# EAGLE design queso_dip_v101 (EAGLE 7.7.0)
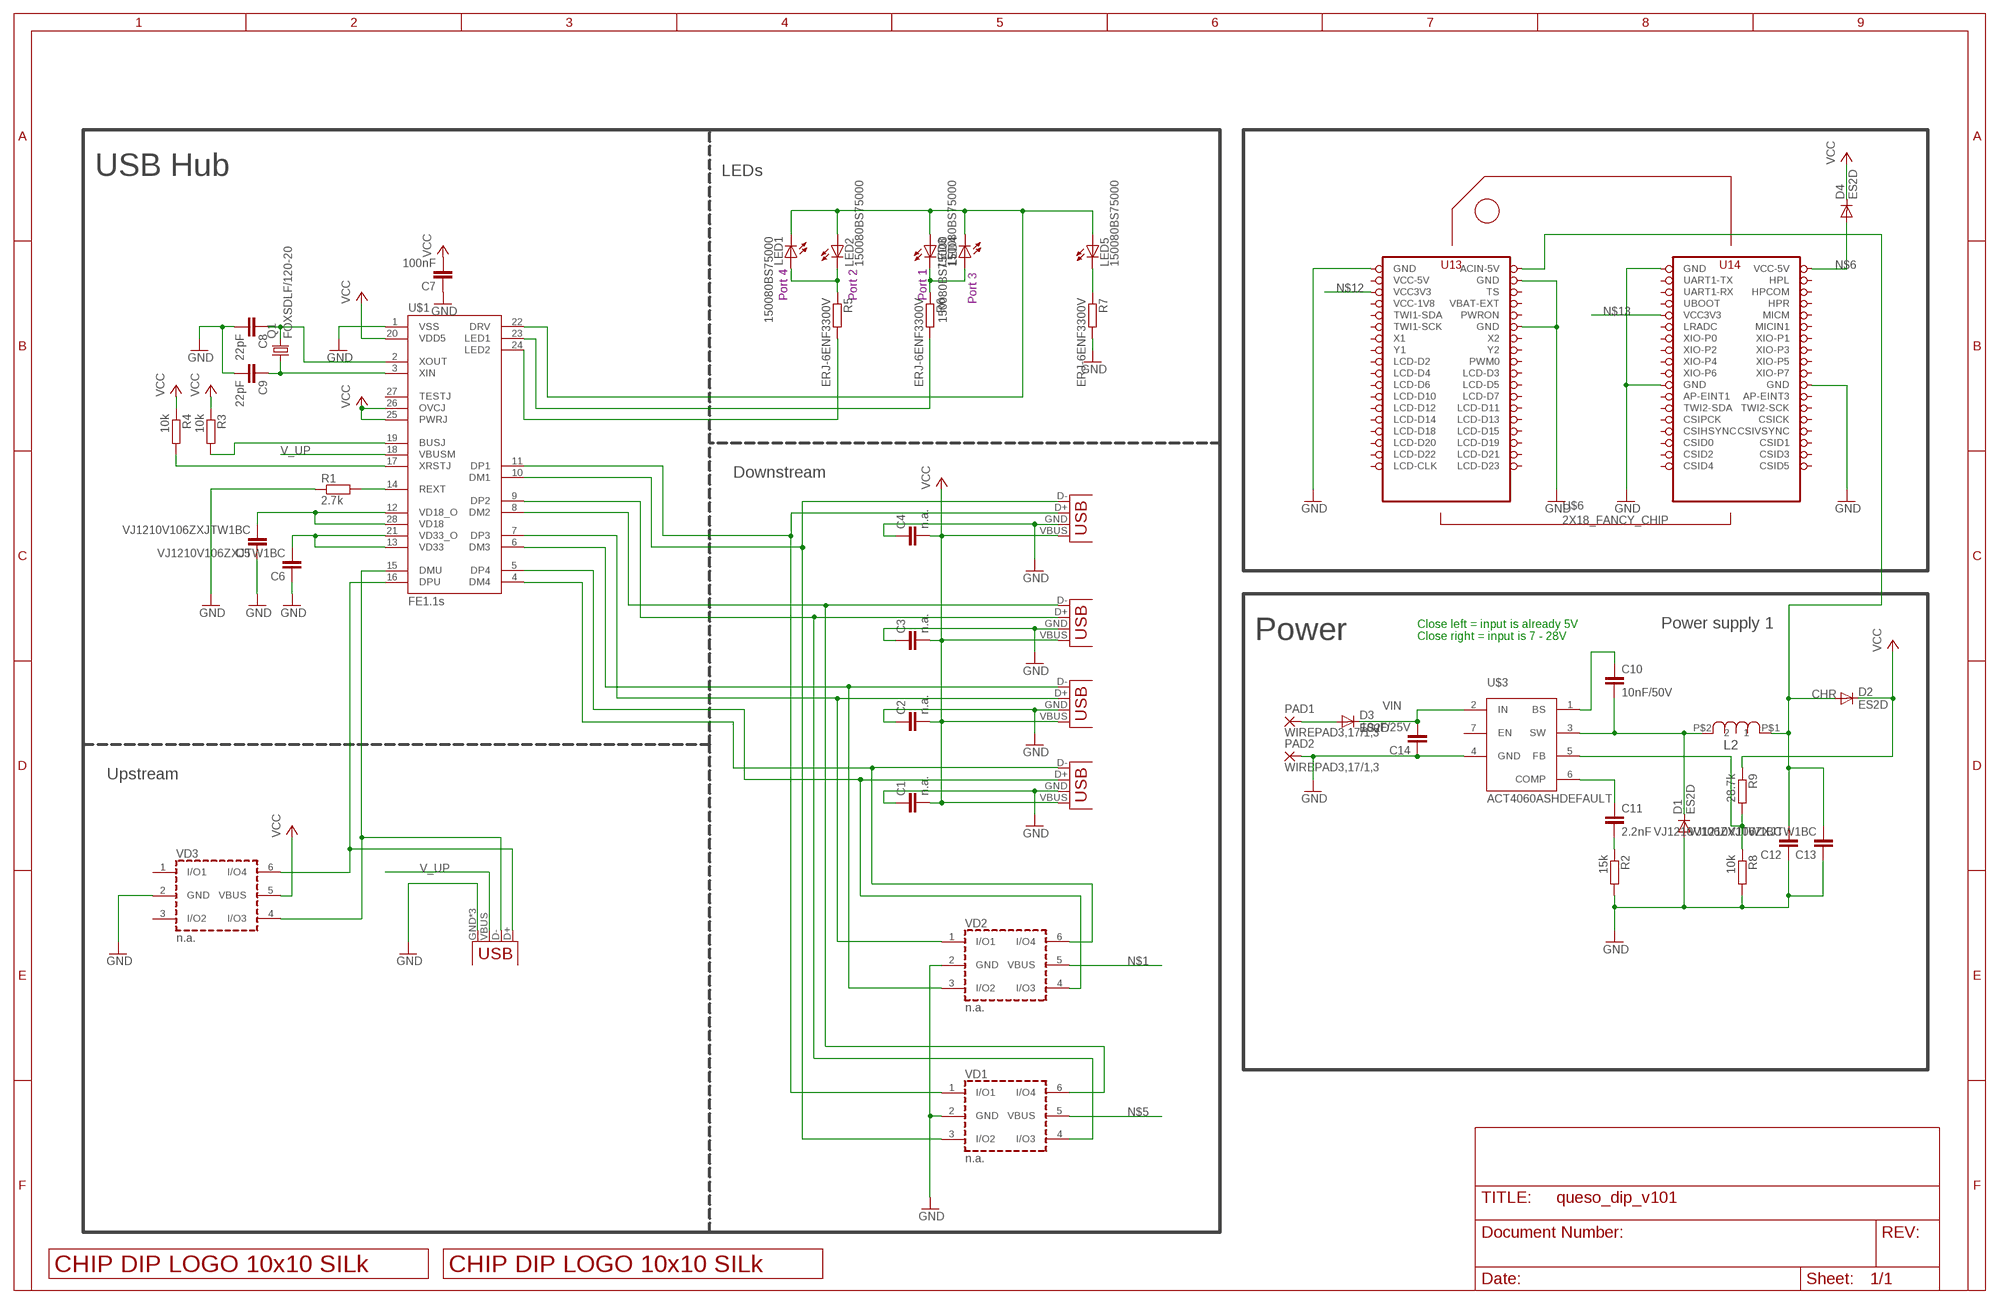
[diagram p0: schematic, sheet 1]

## Parts
C1  n.a.  C-EUC1210  [C1210]
C2  n.a.  C-EUC1210  [C1210]
C3  n.a.  C-EUC1210  [C1210]
C4  n.a.  C-EUC1210  [C1210]
C5  VJ1210V106ZXJTW1BC  C-EUC1210  [C1210]
C6  VJ1210V106ZXJTW1BC  C-EUC1210  [C1210]
C7  100nF  C-EUC0805  [C0805]
C8  22pF  C-EUC0805  [C0805]
C9  22pF  C-EUC0805  [C0805]
C10  10nF/50V  C-EUC0805  [C0805]
C11  2.2nF  C-EUC0805  [C0805]
C12  VJ1210V106ZXJTW1BC  C-EUC1210  [C1210]
C13  VJ1210V106ZXJTW1BC  C-EUC1210  [C1210]
C14  10uF/25V  C-EUC1210  [C1210]
D1  ES2D  [SMB]
D2  ES2D  [SMB]
D3  ES2D  [SMB]
D4  ES2D  [SMB]
DATA_USB  USBUSB-MICROB-SMT-DIP  [USB-MICROB-SMT-DIP]
L2  SRN6045-100M  [SRN6045]
LED1  150080BS75000  LEDCHIP-LED0805  [CHIP-LED0805]
LED2  150080BS75000  LEDCHIP-LED0805  [CHIP-LED0805]
LED3  150080BS75000  LEDCHIP-LED0805  [CHIP-LED0805]
LED4  150080BS75000  LEDCHIP-LED0805  [CHIP-LED0805]
LED5  150080BS75000  LEDCHIP-LED0805  [CHIP-LED0805]
PAD1  WIREPAD3,17/1,3  [3,17/1,3]
PAD2  WIREPAD3,17/1,3  [3,17/1,3]
Q1  FOXSDLF/120-20  CRYSTALSM49  [SM49]
R1  2.7k  R-EU_R0805  [R0805]
R2  15k  R-EU_R0805  [R0805]
R3  10k  R-EU_R0805  [R0805]
R4  10k  R-EU_R0805  [R0805]
R5  ERJ-6ENF3300V  R-EU_R0805  [R0805]
R6  ERJ-6ENF3300V  R-EU_R0805  [R0805]
R7  ERJ-6ENF3300V  R-EU_R0805  [R0805]
R8  10k  R-EU_R0805  [R0805]
R9  28.7k  R-EU_R0805  [R0805]
U$1  FE1.1S  [FE1.1S_SSOP-28]
U$2  LOGO_10X10_SILK  [LOGO2_10X10_SILK]
U$3  ACT4060ASHDEFAULT  [SOP-8]
U$4  LOGO_10X10_SILK  [LOGO2_10X10_SILK]
U$6  2X18_FANCY_CHIP  [2X18_FANCY_EDGE_CHIP_TH]
VD1  n.a.  USBLC6-4SC6  [SOT-23-6L]
VD2  n.a.  USBLC6-4SC6  [SOT-23-6L]
VD3  n.a.  USBLC6-4SC6  [SOT-23-6L]
X1  USB-A-HU  [USB-A-HU]
X2  USB-A-HU  [USB-A-HU]
X3  USB-A-HU  [USB-A-HU]
X4  USB-A-HU  [USB-A-HU]

## Nets
CHR: C12.2 C13.2 D2.A L2.P$1 U$6.36(ACIN-5V)
DM1: U$1.10(DM1) VD1.3(I/O2) X4.D-(D+)
DM2: U$1.8(DM2) VD1.6(I/O4) X3.D-(D+)
DM3: U$1.6(DM3) VD2.3(I/O2) X2.D-(D+)
DM4: U$1.4(DM4) VD2.6(I/O4) X1.D-(D+)
DMU: DATA_USB.D- U$1.15(DMU) VD3.4(I/O3)
DP1: U$1.11(DP1) VD1.1(I/O1) X4.D+(D-)
DP2: U$1.9(DP2) VD1.4(I/O3) X3.D+(D-)
DP3: U$1.7(DP3) VD2.1(I/O1) X2.D+(D-)
DP4: U$1.5(DP4) VD2.4(I/O3) X1.D+(D-)
DPU: DATA_USB.D+ U$1.16(DPU) VD3.6(I/O4)
GND: C1.1 C2.1 C3.1 C4.1 C5.1 C6.1 C7.1 C8.2 C9.2 C12.1 C13.1 C14.1 D1.A DATA_USB.GND DATA_USB.MT1(GND) DATA_USB.MT2(GND) PAD2.1(P) R1.1 R7.2 R8.2 U$1.1(VSS) U$3.4(GND) U$6.26(GND) U$6.34(GND) U$6.35(GND) U$6.51(GND) U$6.52(GND) U$6.71(GND) VD1.2(GND) VD2.2(GND) VD3.2(GND) X1.GND(VBUS) X2.GND(VBUS) X3.GND(VBUS) X4.GND(VBUS)
N$1: VD2.5(VBUS)
N$2: D3.A PAD1.1(P)
N$5: VD1.5(VBUS)
N$6: D4.A U$6.72(VCC-5V)
N$7: C10.2 D1.C L2.P$2 U$3.3(SW)
N$8: C10.1 U$3.1(BS)
N$9: C11.2 R2.1
N$10: C11.1 U$3.6(COMP)
N$11: R8.1 R9.2 U$3.5(FB)
N$12: U$6.31(VCC3V3)
N$13: U$6.63(VCC3V3)
N$14: R5.2 U$1.24(LED2)
N$15: R6.2 U$1.23(LED1)
N$17: C6.2 U$1.13(VD33) U$1.21(VD33_O)
N$18: C5.2 U$1.12(VD18_O) U$1.28(VD18)
N$22: R1.2 U$1.14(REXT)
N$24: R4.2 U$1.17(XRSTJ)
N$25: R3.2 U$1.19(BUSJ)
N$27: C8.1 Q1.2 U$1.2(XOUT)
N$28: C9.1 Q1.1 U$1.3(XIN)
N$29: LED5.C R7.1
N$30: LED3.C LED4.A R6.1
N$31: LED1.A LED2.C R5.1
N$32: LED1.C LED2.A LED3.A LED4.C LED5.A U$1.22(DRV)
V_UP: DATA_USB.VBUS U$1.18(VBUSM)
VCC: C1.2 C2.2 C3.2 C4.2 C7.2 D2.C D4.C R3.1 R4.1 R9.1 U$1.20(VDD5) U$1.25(PWRJ) U$1.26(OVCJ) VD3.5(VBUS) X1.VBUS(GND) X2.VBUS(GND) X3.VBUS(GND) X4.VBUS(GND)
VIN: C14.2 D3.C U$3.2(IN)
Unconnected: R2.2 U$1.27(TESTJ) U$3.7(EN) U$6.1(LCD-CLK) U$6.2(LCD-D23) U$6.3(LCD-D22) U$6.4(LCD-D21) U$6.5(LCD-D20) U$6.6(LCD-D19) U$6.7(LCD-D18) U$6.8(LCD-D15) U$6.9(LCD-D14) U$6.10(LCD-D13) U$6.11(LCD-D12) U$6.12(LCD-D11) U$6.13(LCD-D10) U$6.14(LCD-D7) U$6.15(LCD-D6) U$6.16(LCD-D5) U$6.17(LCD-D4) U$6.18(LCD-D3) U$6.19(LCD-D2) U$6.20(PWM0) U$6.21(Y1) U$6.22(Y2) U$6.23(X1) U$6.24(X2) U$6.25(TWI1-SCK) U$6.27(TWI1-SDA) U$6.28(PWRON) U$6.30(VBAT-EXT) U$6.32(TS) U$6.37(CSID4) U$6.38(CSID5) U$6.39(CSID2) U$6.40(CSID3) U$6.41(CSID0) U$6.42(CSID1) U$6.43(CSIHSYNC) U$6.44(CSIVSYNC) U$6.45(CSIPCK) U$6.46(CSICK) U$6.47(TWI2-SDA) U$6.48(TWI2-SCK) U$6.49(AP-EINT1) U$6.50(AP-EINT3) U$6.53(XIO-P6) U$6.54(XIO-P7) U$6.55(XIO-P4) U$6.56(XIO-P5) U$6.57(XIO-P2) U$6.58(XIO-P3) U$6.59(XIO-P0) U$6.60(XIO-P1) U$6.61(LRADC) U$6.62(MICIN1) U$6.64(MICM) U$6.65(UBOOT) U$6.66(HPR) U$6.67(UART1-RX) U$6.68(HPCOM) U$6.69(UART1-TX) U$6.70(HPL) VD3.1(I/O1) VD3.3(I/O2)

## Notes on the sheet
- USB Hub | LEDs
- Port 4 | Port 2 | Port 1
- Port 3
- Downstream
- Power supply 1
- Power
- Close left = input is already 5V
  Close right = input is 7 - 28V
- Upstream

## Power pins joined to a net without a drawn wire
VCC-1V8: U$6.29(VCC-1V8)
VCC-5V: U$6.33(VCC-5V)

## Library data of the parts
C1-C14 = rcl:C-EU: CAPACITOR, European symbol
D1-D4 = diode:ES2D: DIODE super fast rectifier, 2 A
DATA_USB = Spark:USB
L2 = Keyboard v0_5:SRN6045-100M; DESCRIPTION: power inductor 10uH 2.5A 58.6 mohm; FOOTPRINT: SRN6045; LINK: http://www.digikey.com/product-detail/en/SRN6045-100M/SRN6045-100MTR-ND/2756120; MFG: DIGIKEY; MFG_PN: SRN6045-100MTR-ND; PART_TYPE: IND; PRICE: 0.15; TOLLERANCE: ±20%; VENDOR: BOURNS; VENDOR_PART_NUMBER: SRN6045-100M
LED1-LED5 = led:LED: LED OSRAM: - CHIPLED LG R971, LG N971, LY N971, LG Q971, LY Q971, LO R971, LY R971 LH N974, LH R974 LS Q976, LO Q976, LY Q976 LO Q996 - Hyper CHIPLED LW Q18S LB Q993, LB Q99A, LB R99A - SideLED LS A670, LO A670, LY A670, LG A670, LP A670 LB A673, LV A673, LT A673, LW A673 LH A674 LY A675 LS A676, LA A676, LO A676, LY A676, LW A676 LS A679, LY A679, LG A679 - Hyper Micro SIDELED® LS Y876, LA Y876, LO Y876, LY Y876 LT Y87S - SmartLED LW L88C, LW L88S LB L89C, LB L89S, LG L890 LS L89K, LO L89K, LY L89K LS L896, LA L896, LO L896, LY L896 - TOPLED LS T670, LO T670, LY T670, LG T670, LP T670 LSG T670, LSP T670, LSY T670, LOP T670, LYG T670 LG T671, LOG T671, LSG T671 LB T673, LV T673, LT T673, LW T673 LH T674 LS T676, LA T676, LO T676, LY T676, LB T676, LH T676, LSB T676, LW T676 LB T67C, LV T67C, LT T67C, LS T67K, LO T67K, LY T67K, LW E67C LS E67B, LA E67B, LO E67B, LY E67B, LB E67C, LV E67C, LT E67C LW T67C LS T679, LY T679, LG T679 LS T770, LO T770, LY T770, LG T770, LP T770 LB T773, LV T773, LT T773, LW T773 LH T774 LS E675, LA E675, LY E675, LS T675 LS T776, LA T776, LO T776, LY T776, LB T776 LHGB T686 LT T68C, LB T68C - Hyper Mini TOPLED® LB M676 - Mini TOPLED Santana® LG M470 LS M47K, LO M47K, LY M47K Source: http://www.osram.convergy.de LUXEON: - LUMILED® LXK2-PW12-R00, LXK2-PW12-S00, LXK2-PW14-U00, LXK2-PW14-V00 LXK2-PM12-R00, LXK2-PM12-S00, LXK2-PM14-U00 LXK2-PE12-Q00, LXK2-PE12-R00, LXK2-PE12-S00, LXK2-PE14-T00, LXK2-PE14-U00 LXK2-PB12-K00, LXK2-PB12-L00, LXK2-PB12-M00, LXK2-PB14-N00, LXK2-PB14-P00, LXK2-PB14-Q00 LXK2-PR12-L00, LXK2-PR12-M00, LXK2-PR14-Q00, LXK2-PR14-R00 LXK2-PD12-Q00, LXK2-PD12-R00, LXK2-PD12-S00 LXK2-PH12-R00, LXK2-PH12-S00 LXK2-PL12-P00, LXK2-PL12-Q00, LXK2-PL12-R00 Source: www.luxeon.com KINGBRIGHT: KA-3528ASYC Source: www.kingbright.com
PAD1 PAD2 = wirepad:WIREPAD: Wire PAD connect wire on PCB
Q1 = adafruit:CRYSTAL: CRYSTAL; OC_FARNELL: unknown; OC_NEWARK: unknown
R1-R9 = rcl:R-EU_: RESISTOR, European symbol
U$1 = imcom:FE1.1S: A USB 2.0 hub IC. http://www.jfd-ic.com/Documents/FE1.1s%20Data%20Sheet%20%28Rev.%201.0%29.pdf
U$2 U$4 = JKW_CHIP:LOGO_10X10_SILK
U$3 = JKW_CHIP:ACT4060ASH
U$6 = JKW_CHIP:2X18_FANCY_CHIP
VD1-VD3 = usblc6:USBLC6-4: Automotive very low capacitance ESD protection 4 line Features 4 data-line protection Protects V BUS Very low capacitance: 3 pF Very low leakage current: 10 nA SOT23-6L package RoHS compliant AEC Q101 qualified
X1-X4 = con-usb:USB: USB Connectors

## Board
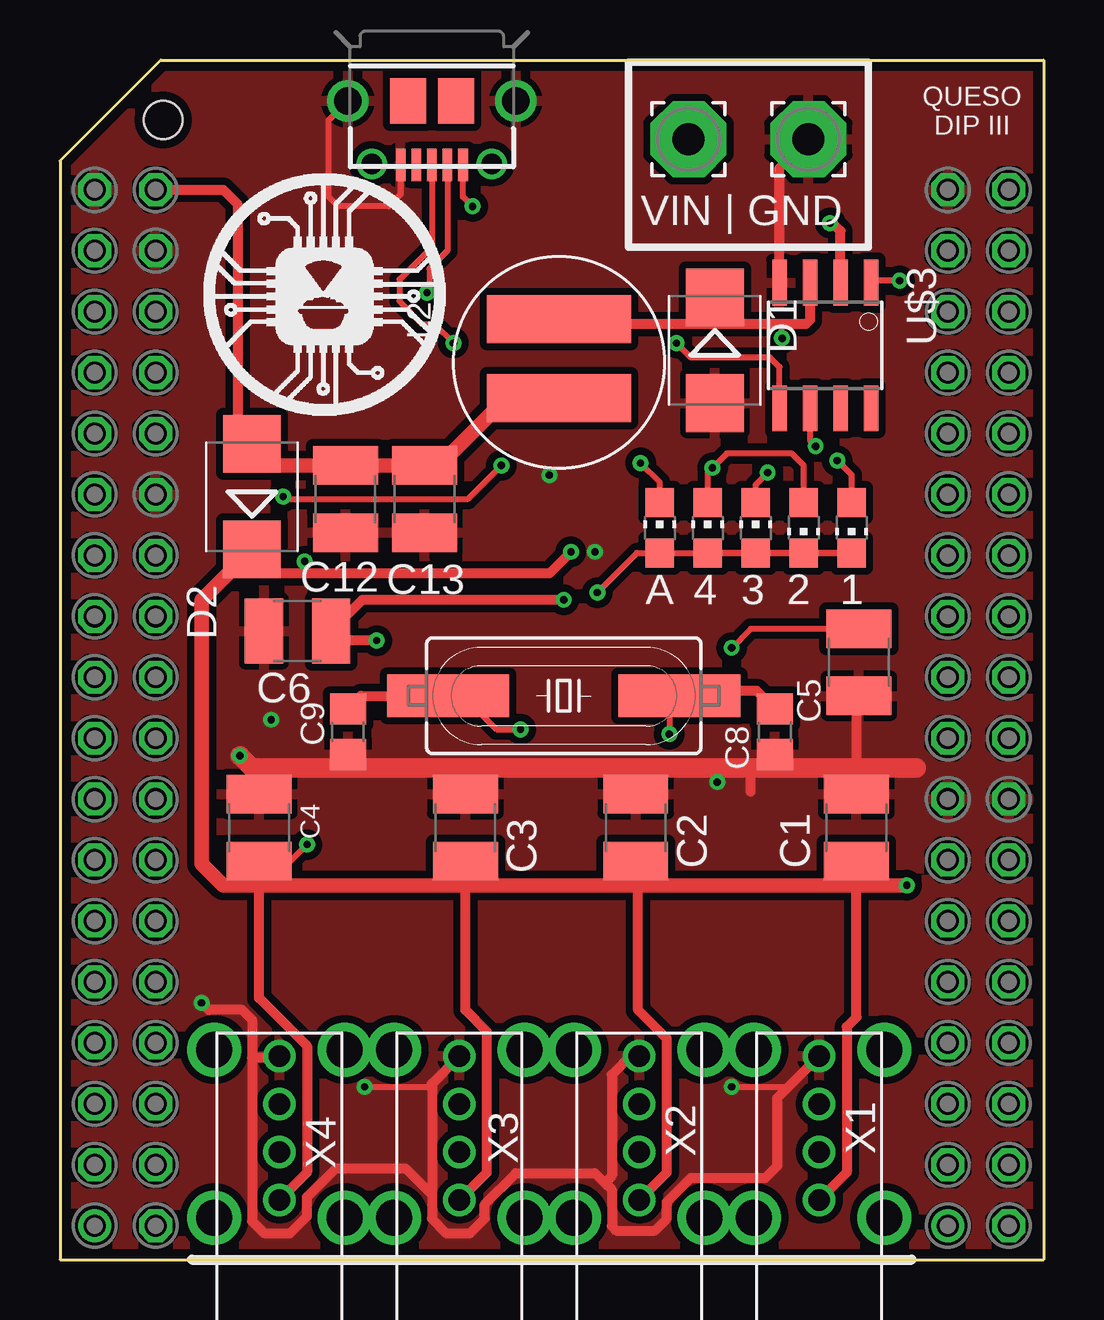
[diagram p1: board, top side]
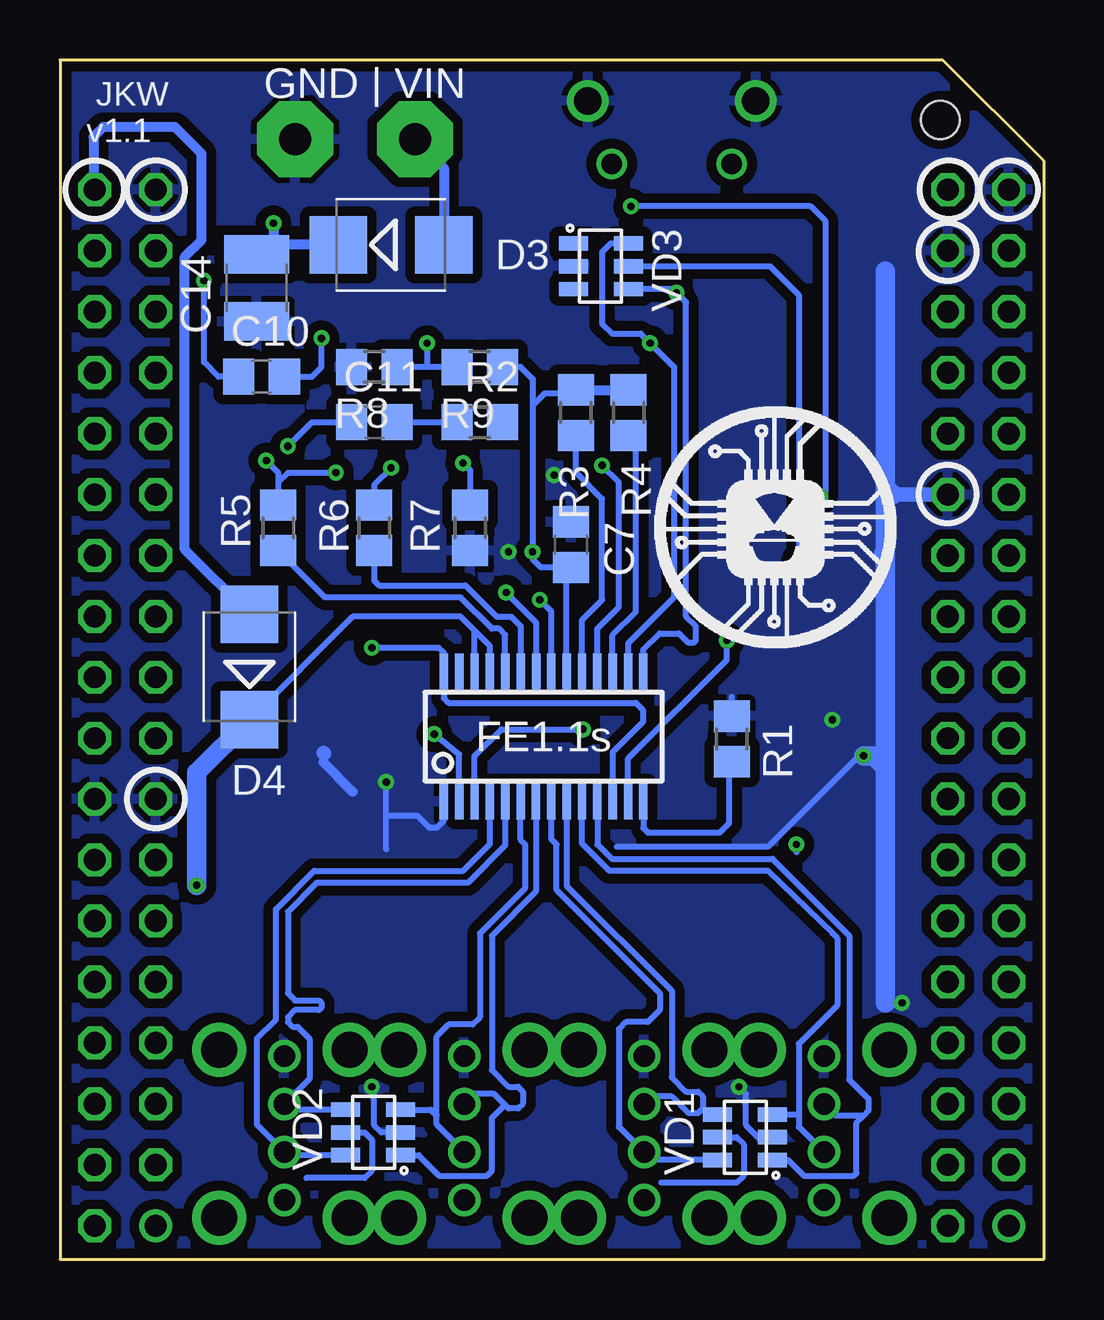
[diagram p2: board, bottom side, seen from below]

Size 41 x 50 mm. Coordinates in mm from the lower left corner, seen from the top.
Copper layers (1*16): Top 0.0356mm / dielectric 1.5011mm / Bottom 0.0356mm
Design rules "LaenPCBOrder": minimum track width 6mil, minimum drill 13mil, track to track 6mil, track to pad 6mil, pad to pad 6mil, via to via 6mil, smd to smd 6mil, copper to edge 15mil, drill to drill 6mil, minimum pad ring 7mil, minimum via ring 7mil, stop-mask expansion 3mil, vias tented up to drill 0mil, thermal gap 10mil
Holes 1.6 mm at 4.3,47.5

### Footprints (pad centres in the part's own frame; a part is rotated, then mirrored left to right if it is on the bottom)
C1210 = smd 1.6 x 2.7: 1 -1.4,0; 2 1.4,0
C0805 = smd 1.3 x 1.5: 1 -0.95,0; 2 0.95,0
SMB = smd 2.4 x 2.4: A 2.2,0; C -2.2,0
USB-MICROB-SMT-DIP = smd 0.4 x 1.35: D+ 0,2.675; D- -0.65,2.675; GND 1.3,2.675; ID 0.65,2.675; VBUS -1.3,2.675 | drill 1.15 pad 1.7: MT1 -3.5,0; MT2 3.5,0 | drill 0.85 pad 1.25: MT3 -2.5,2.625; MT4 2.5,2.625 | smd 1.5 x 1.9: P$1 -1,0; P$2 1,0.01
SRN6045 = smd 2 x 6: P$1 1.5,0; P$2 -1.8,0
CHIP-LED0805 = smd 1.2 x 1.2: A 0,-1.05; C 0,1.05
3,17/1,3 = drill 1.321 pad 3.175 octagon: 1 0,0
SM49 = smd 5.08 x 1.778: 1 -4.826,0; 2 4.826,0
R0805 = smd 1.3 x 1.5: 1 -0.95,0; 2 0.95,0
FE1.1S_SSOP-28 = smd 0.35 x 1.5: 1 -4.16,-2.7; 2 -3.52,-2.7; 3 -2.88,-2.7; 4 -2.24,-2.7; 5 -1.6,-2.7; 6 -0.96,-2.7; 7 -0.32,-2.7; 8 0.32,-2.7; 9 0.96,-2.7; 10 1.6,-2.7; 11 2.24,-2.7; 12 2.88,-2.7; 13 3.52,-2.7; 14 4.16,-2.7; 15 4.16,2.7; 16 3.52,2.7; 17 2.88,2.7; 18 2.24,2.7; 19 1.6,2.7; 20 0.96,2.7; 21 0.32,2.7; 22 -0.3,2.7; 23 -0.96,2.7; 24 -1.6,2.7; 25 -2.24,2.7; 26 -2.88,2.7; 27 -3.52,2.7; 28 -4.16,2.7
SOP-8 = smd 1.905 x 0.61: 1 -2.616,1.905; 2 -2.616,0.635; 3 -2.616,-0.635; 4 -2.616,-1.905; 5 2.616,-1.905; 6 2.616,-0.635; 7 2.616,0.635; 8 2.616,1.905
2X18_FANCY_EDGE_CHIP_TH = drill 0.914: 1 1.45,1.41; 37 37.01,1.41 | drill 0.914 octagon: 2 3.99,1.41; 3 1.45,3.95; 4 3.99,3.95; 5 1.45,6.49; 6 3.99,6.49; 7 1.45,9.03; 8 3.99,9.03; 9 1.45,11.57; 10 3.99,11.57; 11 1.45,14.11; 12 3.99,14.11; 13 1.45,16.65; 14 3.99,16.65; 15 1.45,19.19; 16 3.99,19.19; 17 1.45,21.73; 18 3.99,21.73; 19 1.45,24.27; 20 3.99,24.27; 21 1.45,26.81; 22 3.99,26.81; 23 1.45,29.35; 24 3.99,29.35; 25 1.45,31.89; 26 3.99,31.89; 27 1.45,34.43; 28 3.99,34.43; 29 1.45,36.97; 30 3.99,36.97; 31 1.45,39.51; 32 3.99,39.51; 33 1.45,42.05; 34 3.99,42.05; 35 1.45,44.59; 36 3.99,44.59; 38 39.55,1.41; 39 37.01,3.95; 40 39.55,3.95; 41 37.01,6.49; 42 39.55,6.49; 43 37.01,9.03; 44 39.55,9.03; 45 37.01,11.57; 46 39.55,11.57; 47 37.01,14.11; 48 39.55,14.11; 49 37.01,16.65; 50 39.55,16.65; 51 37.01,19.19; 52 39.55,19.19; 53 37.01,21.73; 54 39.55,21.73; 55 37.01,24.27; 56 39.55,24.27; 57 37.01,26.81; 58 39.55,26.81; 59 37.01,29.35; 60 39.55,29.35; 61 37.01,31.89; 62 39.55,31.89; 63 37.01,34.43; 64 39.55,34.43; 65 37.01,36.97; 66 39.55,36.97; 67 37.01,39.51; 68 39.55,39.51; 69 37.01,42.05; 70 39.55,42.05; 71 37.01,44.59; 72 39.55,44.59 | hole 1.6: 4.3,47.5
SOT-23-6L = smd 0.6 x 1.2: 1 -0.95,-2.3; 2 0,-2.3; 3 0.95,-2.3; 4 0.95,0; 5 0,0; 6 -0.95,0
USB-A-HU = drill 0.9: D+ 4.73,0; D- 2.73,0; GND 6.73,0; VBUS 0.73,0 | drill 1.5: P$5 0,2.72; P$6 0,-2.72; P$7 7,2.72; P$8 7,-2.72

### Placement (x,y rotation side)
C1  33.2,18 270 top
C2  24,18 270 top
C3  16.9,18 270 top
C4  8.3,18 270 top
C5  33.3,24.9 90 top
C6  9.9,26.2 0 top
C7  19.7,29.8 270 bottom
C8  29.8,22 270 top
C9  12,22 270 top
C10  32.6,36.8 0 bottom
C11  27.9,34.9 0 bottom
C12  11.9,31.7 90 top
C13  15.2,31.7 90 top
C14  32.8,40.5 90 bottom
D1  27.3,37.9 270 top
D2  8,31.8 90 top
D3  27.2,42.3 0 bottom
D4  33.1,24.7 90 bottom
DATA_USB  15.5,48.3 180 top
L2  20.8,37.4 270 top
LED1  33,30.5 180 top
LED2  29,30.5 0 top
LED3  27,30.5 0 top
LED4  31,30.5 180 top
LED5  25,30.5 0 top
PAD1  26.2,46.7 0 top
PAD2  31.2,46.7 0 top
Q1  21,23.5 0 top
R1  13,21.7 270 bottom
R2  23.5,34.9 0 bottom
R3  19.5,35.3 270 bottom
R4  17.3,35.3 270 bottom
R5  31.9,30.5 270 bottom
R6  27.9,30.5 270 bottom
R7  23.9,30.5 270 bottom
R8  27.9,37.2 180 bottom
R9  23.5,37.2 180 bottom
U$1  20.84,21.8 0 bottom
U$2  16.2,25.5 0 bottom
U$3  31.9,38.1 270 top
U$4  6,35.2 0 top
U$6  0,0 0 top
VD1  13.6,5.1 90 bottom
VD2  29.1,5.3 90 bottom
VD3  17.3,41.4 270 bottom
X1  31.65,1.75 90 top
X2  24.15,1.75 90 top
X3  16.65,1.75 90 top
X4  9.15,1.75 90 top

### Tracks (layer width: path | path; a pad name or v marks a point on that pad's centre or on a via)
CHR
  Top 0.406: U$6.36 6.81,44.59 7.4,44 7.4,34.6 D2.A
  Top 0.61: L2.P$1 20.6,35.7 18.4,35.7 15.9,33.2 15.3,33.2 C13.2 C12.2 8.9,33.1 D2.A
DM1
  Bottom 0.254: U$1.10 19.24,17.34 18.1,16.2 11.5,16.2 8.79,13.59 8.6,13.4 8.6,10.6 10.2,9 10.2,6 | 10.2,6 10.2,5.53 X4.D- | VD1.3 10.25,6.05 10.2,6
DM2
  Bottom 0.254: U$1.8 20.52,17.52 20.3,17.3 20.3,15.4 16,11.1 16,10.4 16.5,9.9 17.4,9.9 17.7,9.6 17.7,5.53 X3.D- 16.32,4.15 VD1.6
DM3
  Bottom 0.254: U$1.6 21.8,17.5 21.6,17.3 21.6,15.5 23.5,13.6 23.5,10.1 23.8,9.8 24.8,9.8 25.3,9.3 25.3,6 | X2.D- 25.3,5.63 25.3,6 | VD2.3 25.55,6.25 25.3,6
DM4
  Bottom 0.254: U$1.4 23.08,17.32 24.2,16.2 30.4,16.2 32,14.6 32,10 32.8,9.2 32.8,5.63 X1.D- 31.52,4.35 VD2.6
DMU  (via drill 0.3)
  Top 0.254: 15.45,40.45 v15.3,40.3 15.4,40.4 15.4,41.3 16.15,42.05 DATA_USB.D-
  Bottom 0.254: U$1.15 16.68,25.42 16,26.1 15.2,26.1 14.8,25.7 14.6,25.7 14.5,25.8 14.5,26.4 14.9,26.8 14.9,39.9 v15.3,40.3 15.45,40.45 VD3.4
DP1
  Bottom 0.254: U$1.11 18.6,17.3 18,16.7 11.3,16.7 8.1,13.5 8.1,7.5 7.3,6.7 7.3,6.2 7.5,6 | 7.5,6 8.67,6 X4.D+ | VD1.1 10.65,4.15 10,3.5 7.9,3.5 7.8,3.6 7.8,5.7 7.5,6
DP2
  Bottom 0.254: U$1.9 19.88,15.58 15.5,11.2 15.5,7.6 14.9,7 14.4,7 14.2,6.8 14.2,6.3 | 14.2,6.3 14.4,6.1 14.8,6.1 15.5,6.8 16.33,6.8 X3.D+ | VD1.4 13.95,6.05 14.2,6.3
DP3
  Bottom 0.254: U$1.7 21.16,15.34 23,13.5 23,7.9 22.3,7.2 21.9,7.2 21.7,7 21.7,6.5 21.9,6.3 22.3,6.3 22.45,6.45 | 22.45,6.45 22.9,6.9 23.73,6.9 X2.D+ 24.38,6.25 | VD2.1 26.05,4.35 25.2,3.5 23.2,3.5 23,3.7 23,5.9 22.45,6.45
DP4
  Bottom 0.254: U$1.5 22.44,17.26 24,15.7 30.3,15.7 31.5,14.5 31.5,11.1 31.2,10.8 30.2,10.8 30.1,10.7 30.1,10.5 30.2,10.4 31.2,10.4 31.5,10.1 31.5,9.9 31.3,9.7 31.1,9.7 30.6,9.2 30.6,7.53 X1.D+ 31.42,6.25 VD2.4
DPU  (via drill 0.3)
  Top 0.254: DATA_USB.D+ 15.5,42.2 14.15,40.85 14.15,39.95 15.1,39 15.6,39 v16.4,38.2
  Bottom 0.254: U$1.16 17.32,25.68 15.4,27.6 15.4,37.2 v16.4,38.2 16.8,38.6 18,38.6 18.4,39 18.4,42 18.05,42.35 VD3.6
GND  (via drill 0.3)
  Top 0.254: v27.4,19.9 27.4,20.5 | v12.7,7.2 15.37,7.2 15.5,7.33 | 30.47,7.3 30.54,7.37 | v28,7.2 30.37,7.2 30.43,7.26 | DATA_USB.GND 14.2,44.4 13.7,43.9 11.6,43.9 11.2,44.3 11.2,47.5 DATA_USB.MT2
  Top 0.406: v5.9,10.7 6.2,10.4 7.6,10.4 8,10 8,8.4 | 28.8,19.5 28.8,20.3 28.6,20.5 | C9.2 12,20.5 | C5.1 33.2,23.4 33.2,20.5 | 8,8.4 8,1.6 8.5,1.1 9.6,1.1 10.3,1.8 10.3,2.6 11.5,3.8 14.4,3.8 15.5,2.7 | 15.5,2.7 15.5,1.7 16.1,1.1 17.1,1.1 17.7,1.7 17.7,2.3 19,3.6 22.3,3.6 22.7,3.2 | 22.7,3.2 23,2.9 23,1.4 23.2,1.2 24.8,1.2 25.3,1.7 25.3,2.4 26.3,3.4 29.4,3.4 29.9,3.9 29.9,6.73 30.43,7.26 30.54,7.37 X1.GND | X2.GND 23.78,8.48 23,7.7 23,3.5 22.7,3.2 | X3.GND 15.5,7.33 15.5,2.7 | X4.GND 9.07,8.4 8,8.4 | U$3.4 30,45.49 PAD2.1
  Top 0.61: 30,21.1 30,20.5
  Top 0.813: C4.1 8.3,20.3 | 8.3,20.3 8.3,20.5 8,20.5 v7.5,21 | C3.1 16.9,20.5 | 16.9,20.5 24,20.5 | 24,20.5 27.4,20.5 28.6,20.5 30,20.5 33.2,20.5 | 16.9,20.5 12,20.5 8.5,20.5 8.3,20.3 | C1.1 33.2,20.5 | C2.1 24,20.5 | 35.7,20.5 33.2,20.5
  Bottom 0.254: 27.4,17.1 27.4,18.5 | 27.4,18.5 v27.4,19.9 | U$1.1 25,18.3 25.3,18 25.6,18 26.1,18.5 27.4,18.5 | 17.8,17.2 11.5,17.2 7.7,21 v7.5,21 | R1.1 13,23.46 | VD1.2 11.9,5.1 12.4,5.6 12.4,6.9 v12.7,7.2 | VD2.2 27.6,5.3 27.9,5.6 27.9,7.1 v28,7.2
  Bottom 0.406: 6.6,10.7 v5.9,10.7 | 30.02,20.72 28.8,19.5
  Bottom 0.61: 30.02,21.12 30,21.1 | 6.29,31.89 U$6.26
  Bottom 0.813: 6.6,41.2 6.6,32.2 | 6.6,32.2 6.6,29.3 | 6.6,29.3 6.6,20.5 | 6.6,20.5 6.6,10.7 | 6.68,29.38 6.6,29.3 | 6.29,31.89 6.6,32.2 | 6.6,20.5 7.1,21 v7.5,21
  other vias: 22.3,29.5 20.4,32.7 8.8,22.5
  pour Top (isolate 0.305, rank 2): -0.07,0.25 40.88,0.25 41.01,10.57 41.01,50.01 6,50 4.2,50.01 0,45.8 0,10.47
  pour Bottom (isolate 0.406): 4.2,50 41.05,50 41.05,0.25 0.02,0.25 0.02,45.8
N$1
  Bottom 0.254: VD2.5 28.3,5.3 28,5 28,3.7 28.3,3.4 30.73,3.4
N$2
  Bottom 0.406: PAD1.1 25,45.5 D3.A
N$5
  Bottom 0.254: VD1.5 12.8,5.1 12.5,4.8 12.5,3.5 12.8,3.2 15.93,3.2
N$6
  Bottom 0.406: D4.A 35.8,29.6 35.8,41.8 35.1,42.5 35.1,46.1 36.2,47.2 39.2,47.2 39.6,46.8 39.6,44.64 U$6.72
N$7  (via drill 0.3)
  Top 0.254: v30.1,38.4 30.1,38.9 30,39
  Top 0.406: U$3.3 31.27,39.16 31.1,39 30,39 27.1,39 | 27.1,39 21,39 L2.P$2 | D1.C 27.3,39.2 27.1,39
  Bottom 0.254: C10.2 30.5,36.8 30.1,37.2 v30.1,38.4
N$8  (via drill 0.3)
  Top 0.254: v35,40.8 33.89,40.8 U$3.1
  Bottom 0.254: C10.1 34.4,36.8 35,37.4 v35,40.8
N$9
  Bottom 0.254: C11.2 R2.1
N$10  (via drill 0.3)
  Top 0.254: U$3.6 31.27,34.13 v31.5,33.9
  Bottom 0.254: v31.5,33.9 30.5,34.9 C11.1
N$11  (via drill 0.3)
  Top 0.254: U$3.5 30,37.2 29.6,37.6 26.3,37.6 v25.7,38.2
  Bottom 0.254: R9.2 25.7,37.2 | 25.7,37.2 R8.1 | v25.7,38.2 25.7,37.2
N$14
  Bottom 0.254: U$1.24 22.44,26.04 22.7,26.3 23,26.3 24.3,27.6 29.95,27.6 R5.2
N$15
  Bottom 0.254: R6.2 27.9,28.3 27.7,28.1 24.1,28.1 22.8,26.8 22.2,26.8 21.8,26.4 U$1.23
N$17  (via drill 0.3)
  Top 0.406: v21,27.5 12.6,27.5 C6.2 11.2,26.1 11.2,25.6 11.4,25.8 v13.2,25.8
  Bottom 0.254: U$1.13 17.32,20.88 13.2,25 v13.2,25.8 | U$1.21 20.52,27.02 v21,27.5
N$18  (via drill 0.3)
  Top 0.254: v28,25.5 28.8,26.3 C5.2
  Bottom 0.254: v28,25.5 25.2,25.5 25,25.3 U$1.28 25,23.4 24.8,23.2 17,23.2 16.7,22.9 16.7,22.4 17.96,21.14 U$1.12
N$22
  Bottom 0.254: U$1.14 16.68,17.98 16.5,17.8 13.5,17.8 13.1,18.2 13.1,20.65 R1.2
N$24
  Bottom 0.254: U$1.17 17.96,26.04 17,27 17,34.05 R4.2
N$25
  Bottom 0.254: U$1.19 19.24,26.66 18.4,27.5 18.4,31.7 19.5,32.8 R3.2
N$27  (via drill 0.3)
  Top 0.254: Q1.2 25.1,23.7 25.4,23.4 v25.4,21.9
  Top 0.406: C8.1 29.05,23.7 25.1,23.7
  Bottom 0.254: U$1.2 24.36,21.06 v25.4,21.9
N$28  (via drill 0.3)
  Top 0.254: Q1.1 16.6,23.7 18.2,22.1 v19.2,22.1
  Top 0.406: C9.1 12.55,23.5 Q1.1
  Bottom 0.254: U$1.3 23.72,20.98 22.6,22.1 v19.2,22.1
N$29  (via drill 0.3)
  Top 0.254: LED5.C 25,32.4 v24.2,33.2
  Bottom 0.254: v24.2,33.2 23.9,32.9 R7.1
N$30  (via drill 0.3)
  Top 0.254: LED3.C 27,32.8 v27.2,33 27.8,33.6 30.5,33.6 31,33.1 LED4.A
  Bottom 0.254: v27.2,33 27.9,32.3 R6.1
N$31  (via drill 0.3)
  Top 0.254: LED2.C 29,32.3 v29.5,32.8 | LED1.A 33,32.7 v32.4,33.3
  Bottom 0.254: v32.4,33.3 31.9,32.8 R5.1 31.9,32.4 31.5,32.8 v29.5,32.8
N$32  (via drill 0.3)
  Top 0.254: v22.4,27.8 24.05,29.45 LED5.A LED1.C LED4.C LED2.A LED3.A
  Bottom 0.254: U$1.22 21.14,26.54 v22.4,27.8
V_UP  (via drill 0.3)
  Top 0.254: v17.2,43.9 16.8,44.3 DATA_USB.VBUS | v18.4,33.1 17,31.7 9.4,31.7 v9.3,31.8
  Bottom 0.254: U$1.18 18.6,26.3 17.7,27.2 17.7,32.4 v18.4,33.1 | v17.2,43.9 9.7,43.9 9.1,43.3 9.1,32 v9.3,31.8
VCC  (via drill 0.3)
  Top 0.254: v10.3,17.3 9.6,16.6 C4.2 | v10.2,29.1 10.2,28.8 10,28.6
  Top 0.406: X4.VBUS 10.3,3.63 10.3,8.9 8.3,10.9 8.3,15.5 8.2,15.6 8.2,16.2 8.4,16 8.4,15.6 8.3,15.7 C4.2 | X3.VBUS 17.8,3.63 17.8,9.5 16.9,10.4 16.9,15.6 C3.2 | X1.VBUS 32.8,3.63 32.8,9.7 33.2,10.1 C1.2 33.3,16.6 33.3,15.6 | v21.3,29.5 20.4,28.6 10,28.6 9,28.6 D2.C | C2.2 24,15.6 24.1,15.5 24.1,10.4 25.3,9.2 25.3,3.63 X2.VBUS
  Top 0.61: v35.3,15.6 33.3,15.6 24,15.6 16.9,15.6 8.4,15.6 6.8,15.6 5.9,16.5 5.9,27.5 D2.C
  Top 0.813: 24.1,16.5 C2.2
  Bottom 0.254: U$1.25 23.08,25.58 23.72,26.22 | 23.72,26.22 24.3,26.8 28.8,26.8 D4.C | U$1.26 23.72,26.22 | 10.3,16.98 v10.3,17.3 | R3.1 19.65,36.1 20.8,36.1 21.3,35.6 | U$1.20 19.88,28.67 C7.2 20.95,28.85 21.3,29.2 v21.3,29.5 21.3,35.6 | VD3.5 11.4,41.4 10.2,40.2 v10.2,29.1 | 21.3,35.6 21.3,36.7 21.8,37.2 R9.1
  Bottom 0.406: R3.1 R4.1
  Bottom 0.813: D4.C 35.3,20.3 v35.3,15.6
VIN  (via drill 0.3)
  Top 0.406: U$3.2 32.53,42.87 32.1,43.3 v32.1,43.2
  Bottom 0.406: D3.C 32.4,42.3 C14.2 32.1,42.6 v32.1,43.2

### Text on the board
Unrouted: not ordered
bPlace: JKW / v1.1
tNames: QUESO / DIP III | VIN | GND | A | 4 | 3 | 2 | 1
bNames: GND | VIN